# EAGLE design debug_rs232 (EAGLE 5.10)
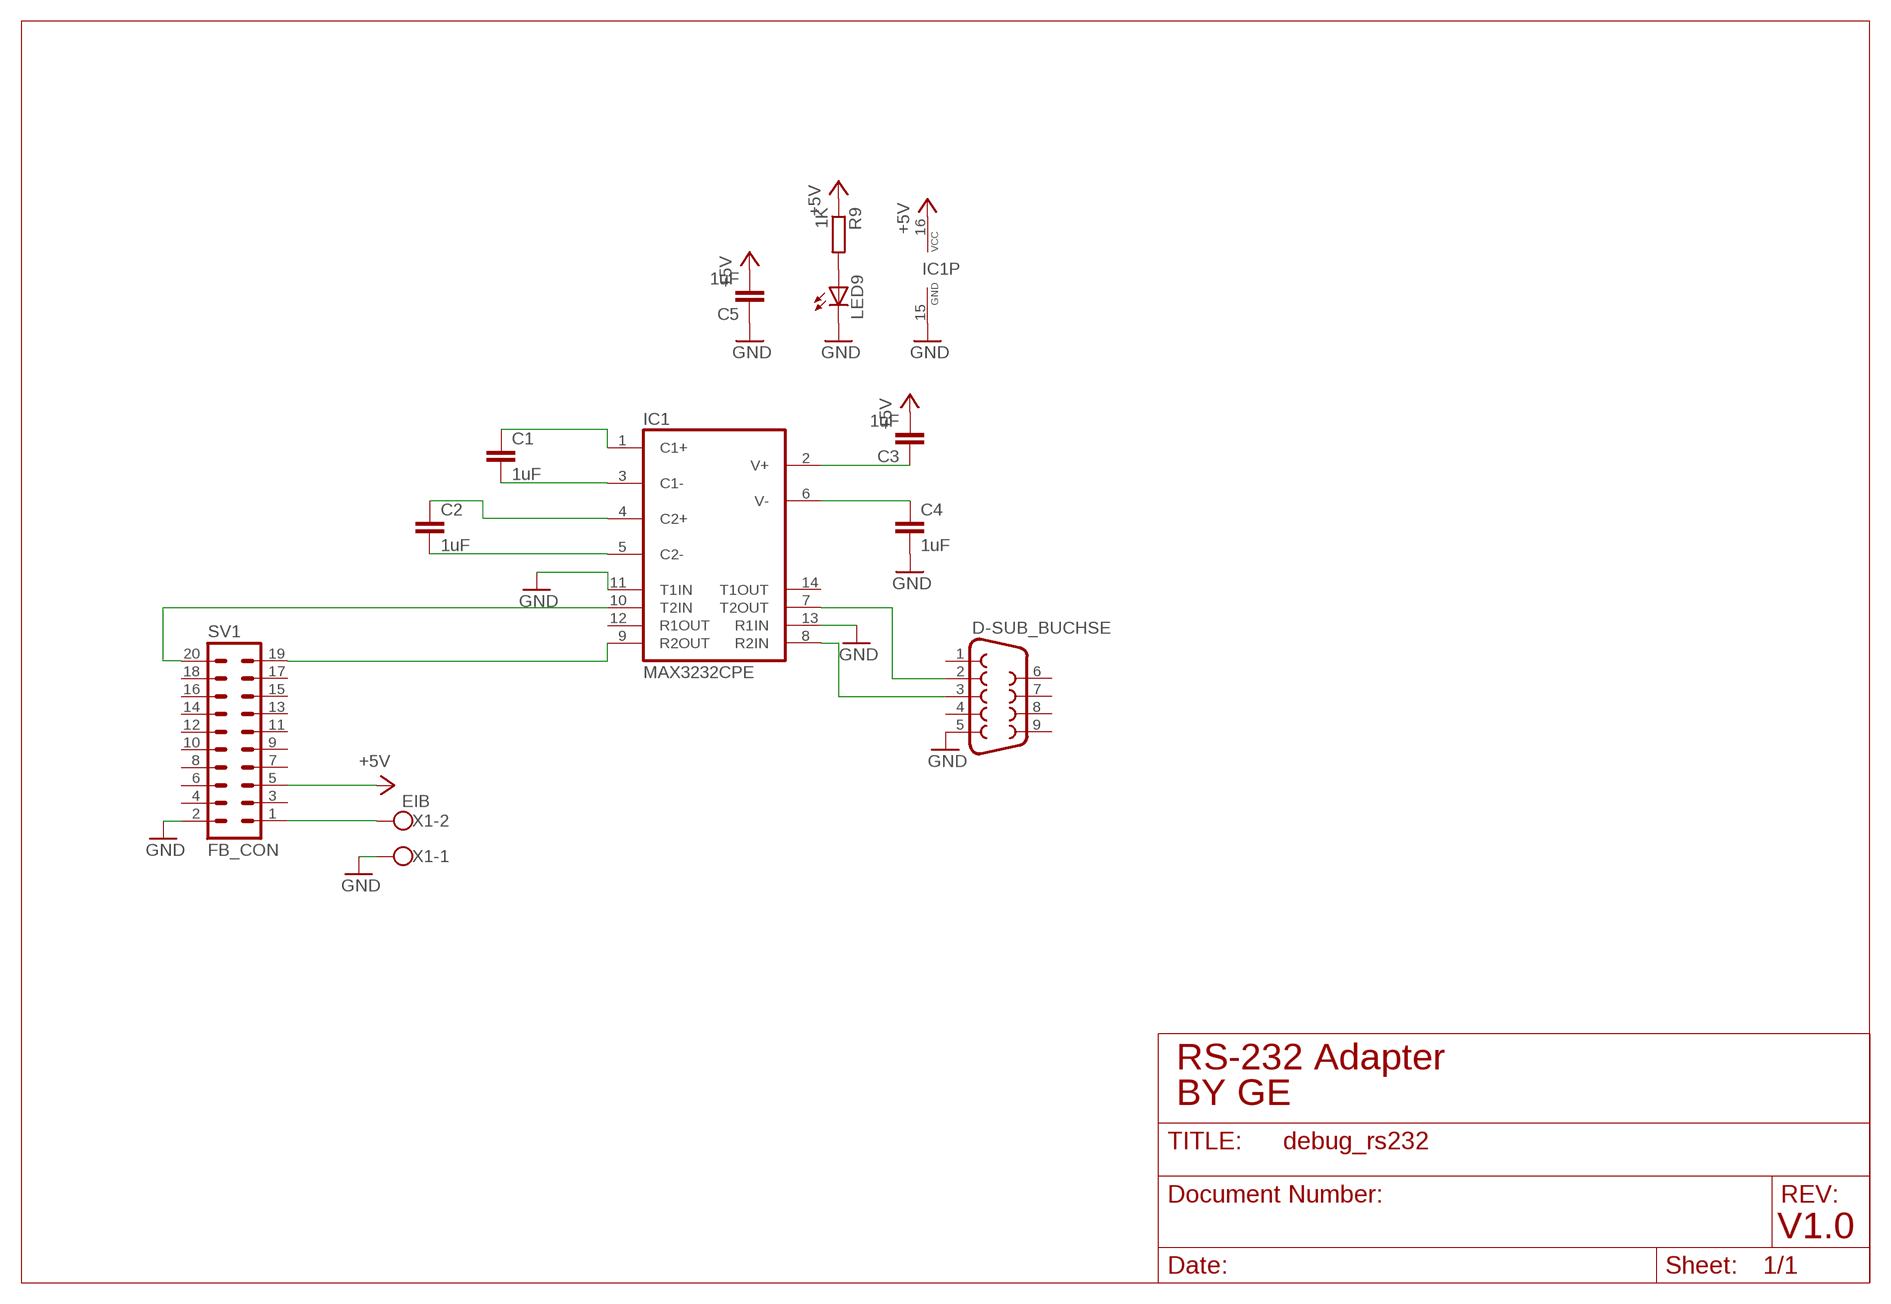
[diagram p0: schematic, sheet 1]

## Parts
C1  1uF  C-EU050-075X075  [C050-075X075]
C2  1uF  C-EU050-075X075  [C050-075X075]
C3  1uF  C-EU050-075X075  [C050-075X075]
C4  1uF  C-EU050-075X075  [C050-075X075]
C5  1uF  C-EU050-075X075  [C050-075X075]
D-SUB_BUCHSE  F09HP  [F09HP]
IC1  MAX3232CPE  [DIL16]
LED9  LED3MM  [LED3MM]
R9  1K  R-EU_0204/2V  [0204V]
SV1  FB_CON  ML20  [ML20]
X1  EIB  W237-102  [W237-102]

## Nets
+5V: C3.2 C5.2 IC1.16(VCC) R9.1 SV1.5
GND: C4.2 C5.1 D-SUB_BUCHSE.5 IC1.11(T1IN) IC1.13(R1IN) IC1.15(GND) LED9.K(C) SV1.2 X1.1
N$1: C1.2 IC1.3(C1-)
N$2: C1.1 IC1.1(C1+)
N$3: C2.2 IC1.5(C2-)
N$4: C2.1 IC1.4(C2+)
N$5: C4.1 IC1.6(V-)
N$6: C3.1 IC1.2(V+)
N$7: IC1.10(T2IN) SV1.20
N$8: SV1.1 X1.2
N$9: D-SUB_BUCHSE.2 IC1.7(T2OUT)
N$10: D-SUB_BUCHSE.3 IC1.8(R2IN)
N$11: IC1.9(R2OUT) SV1.19
N$25: LED9.A R9.2
Unconnected: D-SUB_BUCHSE.1 D-SUB_BUCHSE.4 D-SUB_BUCHSE.6 D-SUB_BUCHSE.7 D-SUB_BUCHSE.8 D-SUB_BUCHSE.9 IC1.12(R1OUT) IC1.14(T1OUT) SV1.3 SV1.4 SV1.6 SV1.7 SV1.8 SV1.9 SV1.10 SV1.11 SV1.12 SV1.13 SV1.14 SV1.15 SV1.16 SV1.17 SV1.18

## Notes on the sheet
- RS-232 Adapter
- BY GE
- V1.0

## Library data of the parts
C1-C5 = rcl:C-EU: CAPACITOR, European symbol
D-SUB_BUCHSE = con-subd:F09: SUB-D
IC1 = maxim:MAX3232*: True RS-232 Transceivers 3.0V to 5.5V, Low-Power up to 1Mbps, Using Four 0.1µF External Capacitors Source: http://pdfserv.maxim-ic.com/en/ds/MAX3222-MAX3241.pdf
LED9 = led:LED: LED OSRAM: - CHIPLED LG R971, LG N971, LY N971, LG Q971, LY Q971, LO R971, LY R971 LH N974, LH R974 LS Q976, LO Q976, LY Q976 LO Q996 - Hyper CHIPLED LW Q18S LB Q993, LB Q99A, LB R99A - SideLED LS A670, LO A670, LY A670, LG A670, LP A670 LB A673, LV A673, LT A673, LW A673 LH A674 LY A675 LS A676, LA A676, LO A676, LY A676, LW A676 LS A679, LY A679, LG A679 - Hyper Micro SIDELED® LS Y876, LA Y876, LO Y876, LY Y876 LT Y87S - SmartLED LW L88C, LW L88S LB L89C, LB L89S, LG L890 LS L89K, LO L89K, LY L89K LS L896, LA L896, LO L896, LY L896 - TOPLED LS T670, LO T670, LY T670, LG T670, LP T670 LSG T670, LSP T670, LSY T670, LOP T670, LYG T670 LG T671, LOG T671, LSG T671 LB T673, LV T673, LT T673, LW T673 LH T674 LS T676, LA T676, LO T676, LY T676, LB T676, LH T676, LSB T676, LW T676 LB T67C, LV T67C, LT T67C, LS T67K, LO T67K, LY T67K, LW E67C LS E67B, LA E67B, LO E67B, LY E67B, LB E67C, LV E67C, LT E67C LW T67C LS T679, LY T679, LG T679 LS T770, LO T770, LY T770, LG T770, LP T770 LB T773, LV T773, LT T773, LW T773 LH T774 LS E675, LA E675, LY E675, LS T675 LS T776, LA T776, LO T776, LY T776, LB T776 LHGB T686 LT T68C, LB T68C - Hyper Mini TOPLED® LB M676 - Mini TOPLED Santana® LG M470 LS M47K, LO M47K, LY M47K Source: http://www.osram.convergy.de LUXEON: - LUMILED® LXK2-PW12-R00, LXK2-PW12-S00, LXK2-PW14-U00, LXK2-PW14-V00 LXK2-PM12-R00, LXK2-PM12-S00, LXK2-PM14-U00 LXK2-PE12-Q00, LXK2-PE12-R00, LXK2-PE12-S00, LXK2-PE14-T00, LXK2-PE14-U00 LXK2-PB12-K00, LXK2-PB12-L00, LXK2-PB12-M00, LXK2-PB14-N00, LXK2-PB14-P00, LXK2-PB14-Q00 LXK2-PR12-L00, LXK2-PR12-M00, LXK2-PR14-Q00, LXK2-PR14-R00 LXK2-PD12-Q00, LXK2-PD12-R00, LXK2-PD12-S00 LXK2-PH12-R00, LXK2-PH12-S00 LXK2-PL12-P00, LXK2-PL12-Q00, LXK2-PL12-R00 Source: www.luxeon.com KINGBRIGHT: KA-3528ASYC Source: www.kingbright.com
R9 = rcl:R-EU_: RESISTOR, European symbol
SV1 = con-harting-ml:ML20: HARTING
X1 = con-wago-500:W237-102: WAGO SCREW CLAMP

## Board
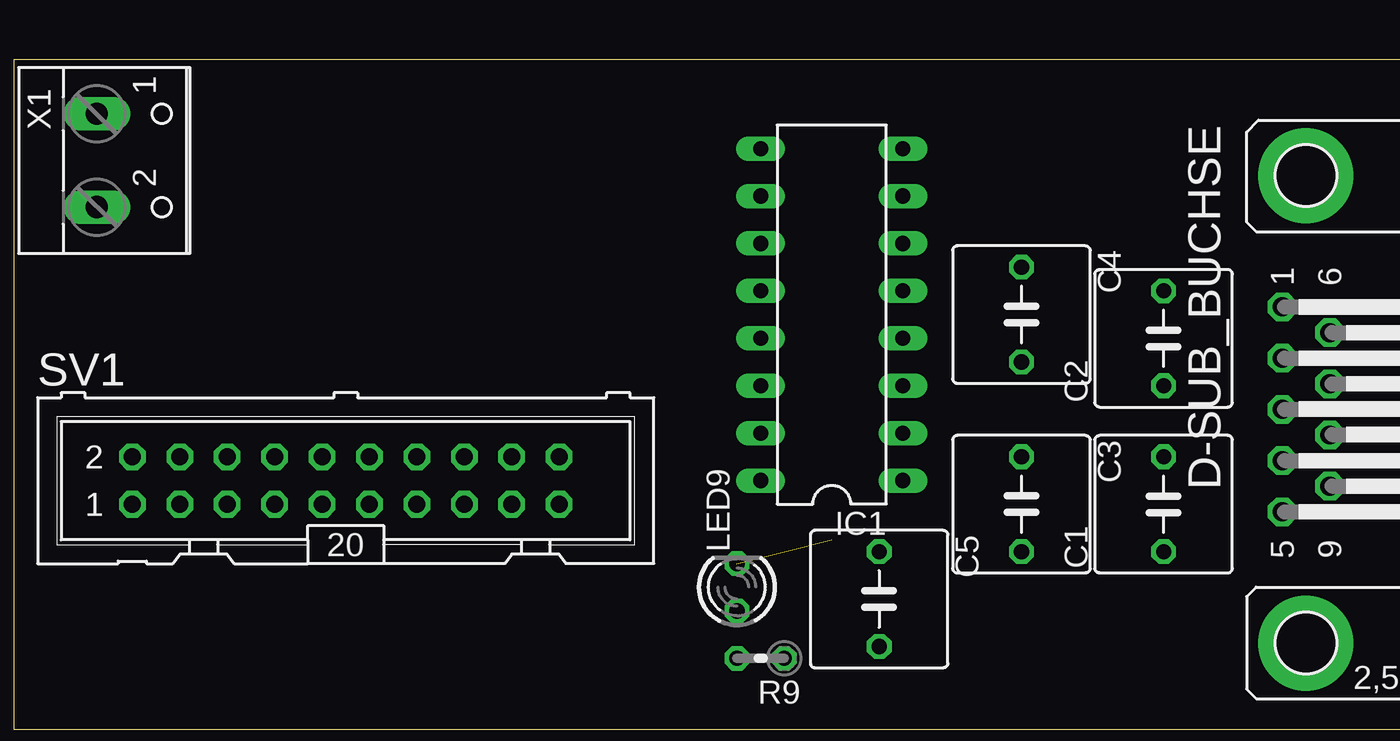
[diagram p1: board, top side]
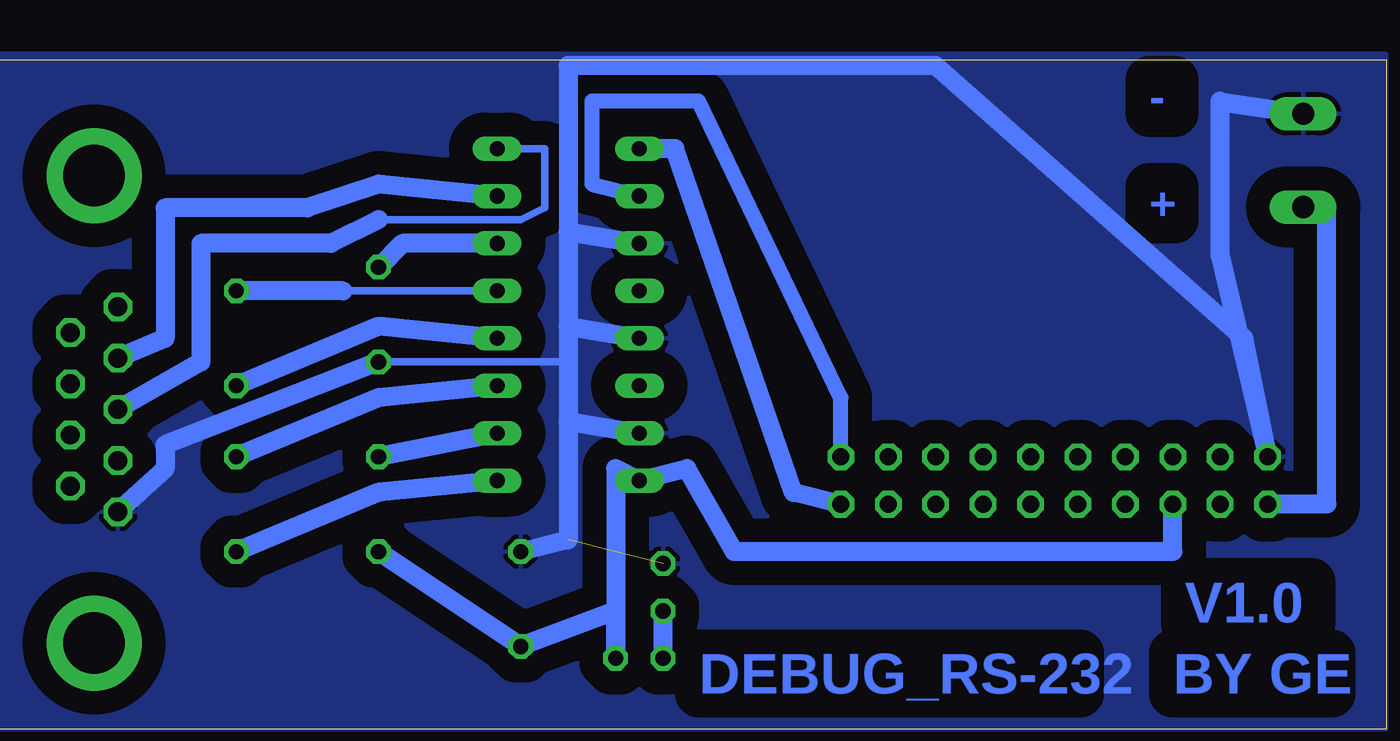
[diagram p2: board, bottom side, seen from below]

No outline drawn. Coordinates in mm, seen from the top.
Copper layers (1*16): Top 0.035mm / dielectric 1.5mm / Bottom 0.035mm
Design rules "0.3mm": minimum track width 10mil, minimum drill 24mil, track to track 0.3mm, track to pad 0.3mm, pad to pad 0.3mm, via to via 0.3mm, smd to smd 0.3mm, copper to edge 0mil, drill to drill 8mil, minimum pad ring 10mil, minimum via ring 8mil, stop-mask expansion 4mil, vias tented up to drill 0mil, thermal gap 10mil
Milling: 4 lines

### Footprints (pad centres in the part's own frame; a part is rotated, then mirrored left to right if it is on the bottom)
C050-075X075 = drill 0.813 octagon: 1 -2.54,0; 2 2.54,0
F09HP = drill 1.016 octagon: 1 -5.486,-1.27; 2 -2.743,-1.27; 3 0,-1.27; 4 2.743,-1.27; 5 5.486,-1.27; 6 -4.115,1.27; 7 -1.372,1.27; 8 1.372,1.27; 9 4.115,1.27 | drill 3.302 pad 5.08 round: G1 -12.522,0; G2 12.522,0
DIL16 = drill 0.813 long: 1 -8.89,-3.81; 2 -6.35,-3.81; 3 -3.81,-3.81; 4 -1.27,-3.81; 5 1.27,-3.81; 6 3.81,-3.81; 7 6.35,-3.81; 8 8.89,-3.81; 9 8.89,3.81; 10 6.35,3.81; 11 3.81,3.81; 12 1.27,3.81; 13 -1.27,3.81; 14 -3.81,3.81; 15 -6.35,3.81; 16 -8.89,3.81
LED3MM = drill 0.813 octagon: A -1.27,0; K 1.27,0
0204V = drill 0.813 octagon: 1 -1.27,0; 2 1.27,0
ML20 = drill 0.914 octagon: 1 -11.43,-1.27; 2 -11.43,1.27; 3 -8.89,-1.27; 4 -8.89,1.27; 5 -6.35,-1.27; 6 -6.35,1.27; 7 -3.81,-1.27; 8 -3.81,1.27; 9 -1.27,-1.27; 10 -1.27,1.27; 11 1.27,-1.27; 12 1.27,1.27; 13 3.81,-1.27; 14 3.81,1.27; 15 6.35,-1.27; 16 6.35,1.27; 17 8.89,-1.27; 18 8.89,1.27; 19 11.43,-1.27; 20 11.43,1.27
W237-102 = drill 1.194 long: 1 -2.5,-1.27; 2 2.5,-1.27

### Placement (x,y rotation side)
C1  61.59,12.06 90 top
C2  61.59,20.95 90 top
C3  53.98,12.06 270 top
C4  53.98,22.23 270 top
C5  46.35,6.99 270 top
D-SUB_BUCHSE  69.22,17.14 270 top
IC1  43.81,22.23 90 top
LED9  38.73,7.62 90 top
R9  40.01,3.81 180 top
SV1  17.78,13.34 0 top
X1  5.71,30.48 270 top

### Tracks (layer width: path | path; a pad name or v marks a point on that pad's centre or on a via)
+5V
  Bottom 1.016: C3.2 C5.2 41.27,6.35 R9.1 41.27,13.97 IC1.16 37.47,13.97 34.92,9.53 11.43,9.53 SV1.5
GND  (1 unrouted)
  Bottom 0.406: 43.81,19.68 C4.2
  Bottom 1.016: C4.2 65.41,15.24 65.41,13.97 D-SUB_BUCHSE.5 | 43.81,16.51 43.81,19.68 43.81,21.59 | 43.81,16.51 IC1.15 | 43.81,21.59 IC1.13 | 43.81,26.67 IC1.11 | 43.81,26.67 43.81,21.59 | C5.1 43.81,10.16 43.81,16.51 | 8.89,33.62 8.89,25.4 SV1.2 7.62,20.95 24.13,35.56 43.81,35.56 43.81,26.67 | 8.89,33.62 8.89,33.66 | 8.89,33.62 X1.1
  pour Bottom (isolate 1.27): 0,0 81.28,0 81.28,36.2 0,36.2
N$1
  Bottom 1.016: C1.2 53.98,17.78 IC1.3
N$2
  Bottom 1.016: IC1.1 53.98,12.7 C1.1
N$3
  Bottom 0.406: IC1.5 55.88,23.5
  Bottom 1.016: 55.88,23.5 C2.2
N$4
  Bottom 1.016: IC1.4 53.98,21.59 C2.1
N$5
  Bottom 1.016: IC1.6 52.7,26.04 C4.1
N$6
  Bottom 1.016: IC1.2 C3.1
N$7
  Bottom 0.813: SV1.20 29.21,17.78 36.83,33.66 42.55,33.66 42.55,29.21 IC1.10
N$8
  Bottom 1.016: X1.2 3.17,27.98 3.17,12.06 SV1.1
N$9
  Bottom 1.016: IC1.7 53.98,29.21 57.78,27.94 65.41,27.94 65.41,20.95 D-SUB_BUCHSE.2
N$10
  Bottom 0.406: 53.98,27.3 46.35,27.3 45.09,27.94 45.09,31.11 IC1.8
  Bottom 1.016: D-SUB_BUCHSE.3 63.5,19.68 63.5,26.04 56.52,26.04 53.98,27.3
N$11
  Bottom 1.016: SV1.19 31.75,12.7 38.1,31.11 IC1.9
N$25
  Bottom 1.016: R9.2 LED9.A

### Text on the board
Bottom: - | + | V1.0 | BY GE | DEBUG_RS-232